# EAGLE design USB Serial (EAGLE 6.5.0)
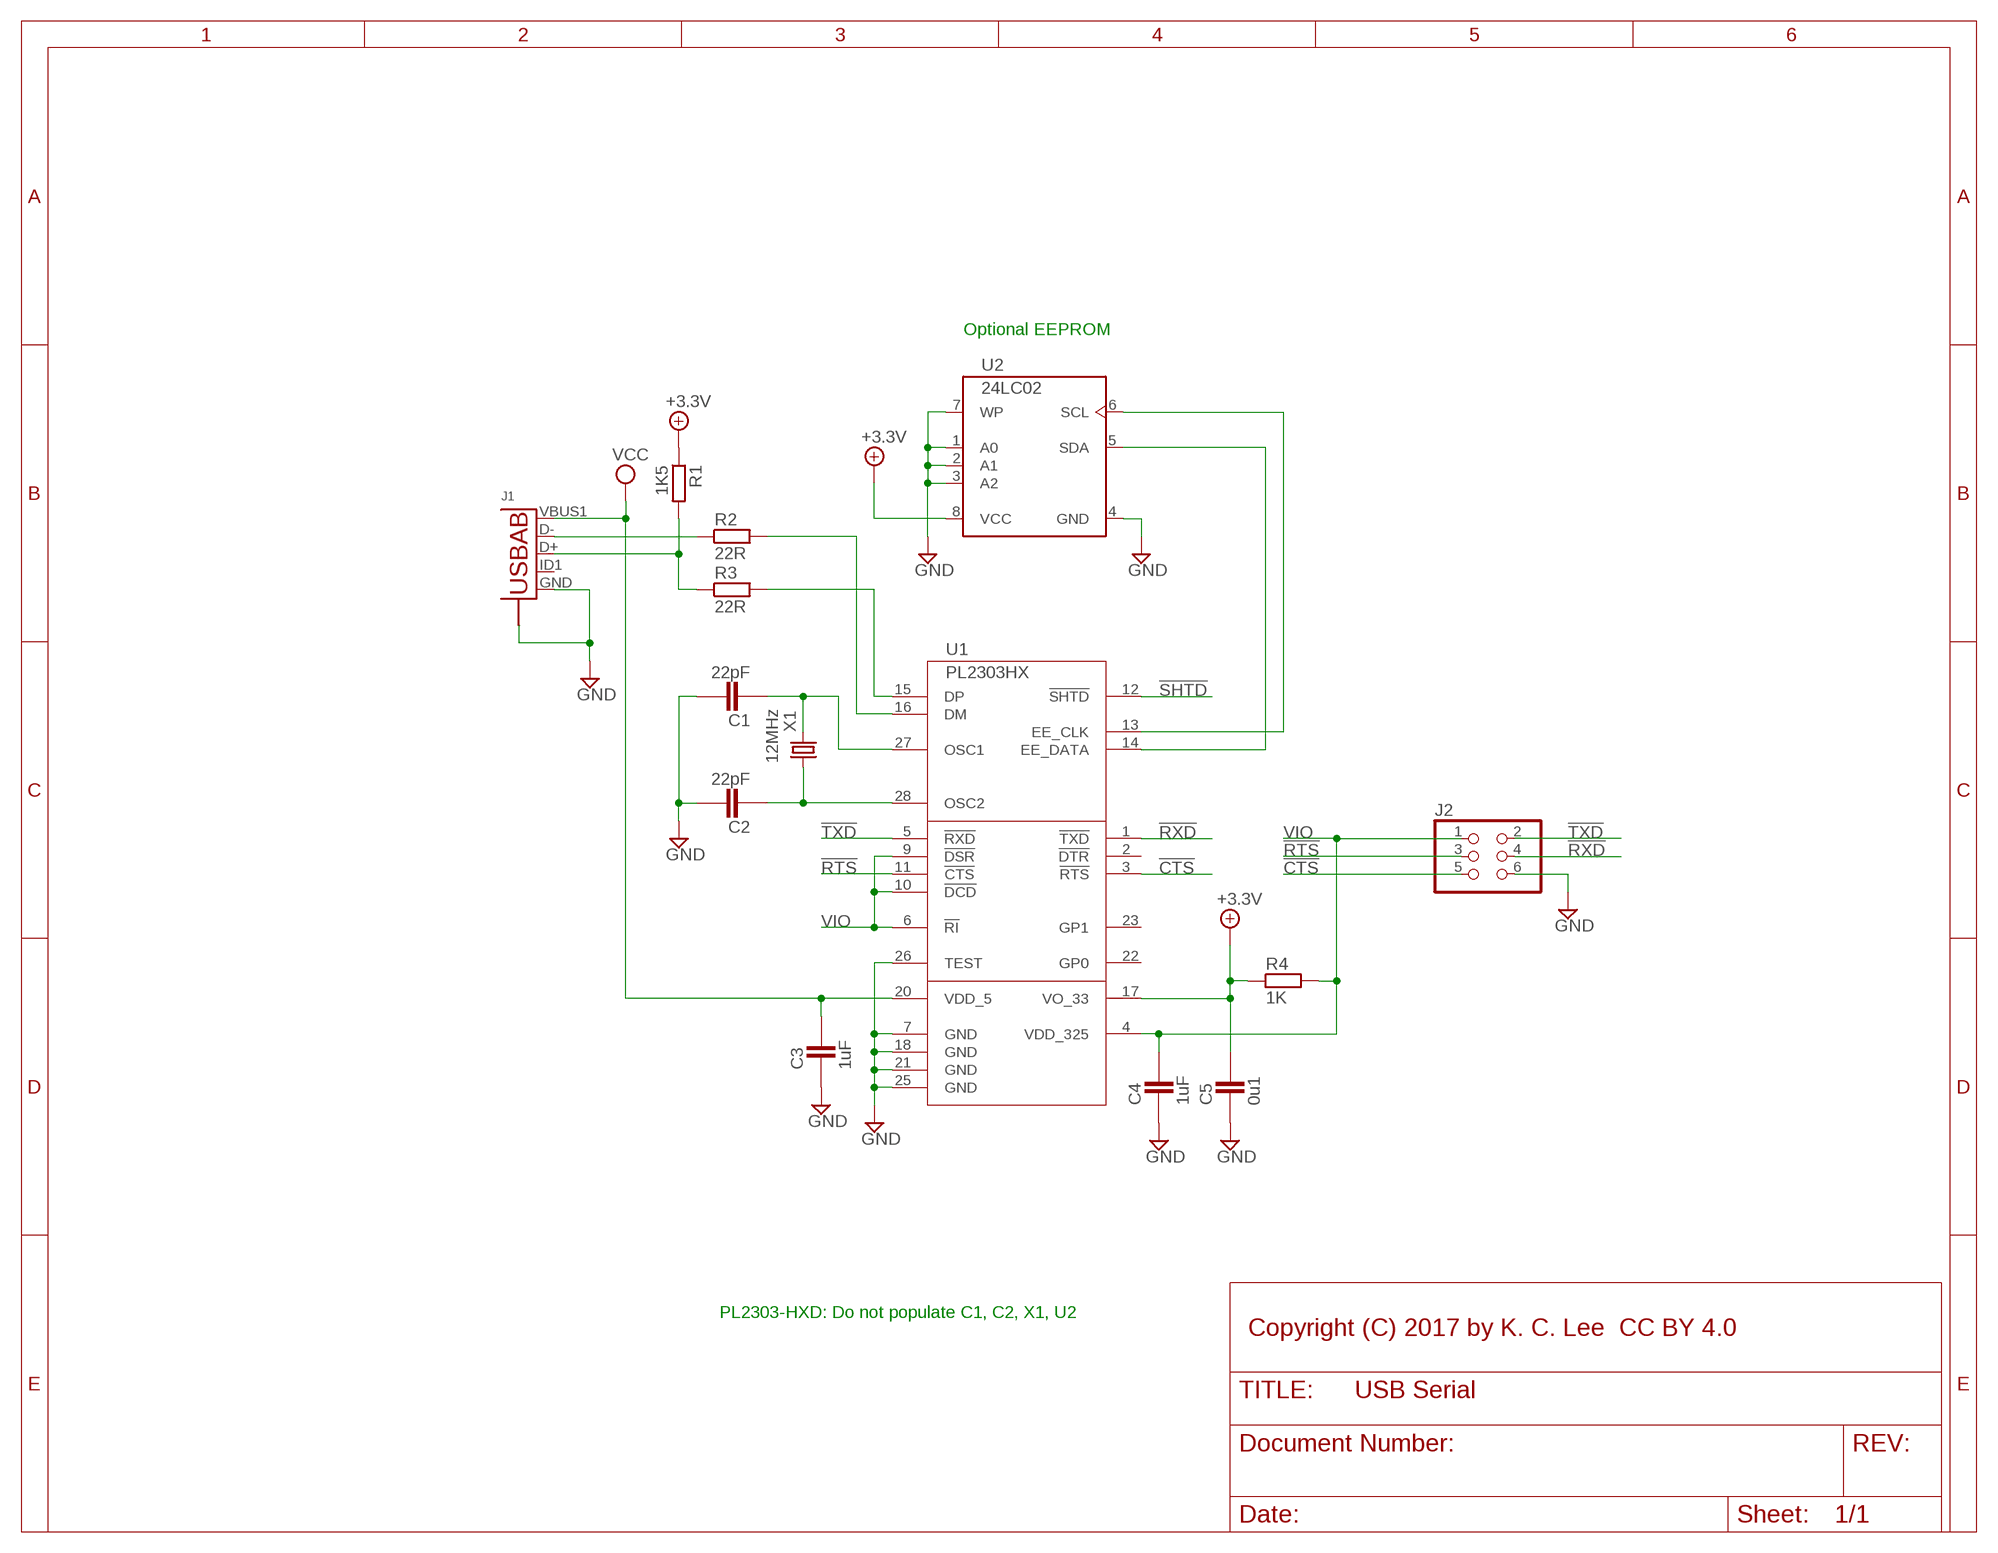
[diagram p0: schematic, sheet 1]

## Parts
C1  22pF  CAPACITOR_0603  [CAPC1608X92N]
C2  22pF  CAPACITOR_0603  [CAPC1608X92N]
C3  1uF  CAPACITOR_0603  [CAPC1608X92N]
C4  1uF  CAPACITOR_0603  [CAPC1608X92N]
C5  0u1  CAPACITOR_0603  [CAPC1608X92N]
J1  USB-ABBG-ORG  [USB-AB-MICRO-SMD_V03_SMT]
J2  PINHD-2X3_2.00  [2X03M_TH]
R1  1K5  RESISTOR_0603  [RESC1608X55N]
R2  22R  RESISTOR_0603  [RESC1608X55N]
R3  22R  RESISTOR_0603  [RESC1608X55N]
R4  1K  RESISTOR_0603  [RESC1608X55N]
U1  PL2303HX  PL2303HXASSOP  [SSOP28DB]
U2  24LC02  24ST  [TSSOP8]
X1  12MHz  CRYSTALTC26H  [TC26H]

## Nets
!CTS: J2.5 U1.3(!RTS)
!RTS: J2.3 U1.11(!CTS)
!RXD: J2.4 U1.1(!TXD)
!SHTD: U1.12(!SHTD)
!TXD: J2.2 U1.5(!RXD)
+3.3V: C5.2 R1.1 R4.1 U1.17(VO_33) U2.8(VCC)
GND: C1.2 C2.2 C3.1 C4.1 C5.1 J1.GND J1.S1(S) J1.S2(S) J1.S3(S) J1.S4(S) J2.6 U1.7(GND) U1.18(GND) U1.21(GND) U1.25(GND) U1.26(TEST) U2.1(A0) U2.2(A1) U2.3(A2) U2.4(GND) U2.7(WP)
N$4: R3.2 U1.15(DP)
N$5: J1.D+ R1.2 R3.1
N$6: J1.D- R2.1
N$7: R2.2 U1.16(DM)
N$9: U1.14(EE_DATA) U2.5(SDA)
N$10: U1.13(EE_CLK) U2.6(SCL)
N$13: C1.1 U1.27(OSC1) X1.2
N$14: C2.1 U1.28(OSC2) X1.1
VCC: C3.2 J1.VBUS1(VBUS) U1.20(VDD_5)
VIO: C4.2 J2.1 R4.2 U1.4(VDD_325) U1.6(!RI) U1.9(!DSR) U1.10(!DCD)
Unconnected: J1.ID1(USBID) U1.2(!DTR) U1.22(GP0) U1.23(GP1)

## Notes on the sheet
- Optional EEPROM
- PL2303-HXD: Do not populate C1, C2, X1, U2 | Copyright (C) 2017 by K. C. Lee  CC BY 4.0

## Library data of the parts
C1 C2 = ipc-7351-capacitor:CAPACITOR_; PARTNO: 22PF 0603
C3 C4 = ipc-7351-capacitor:CAPACITOR_; PARTNO: 1UF X7R 0603
C5 = ipc-7351-capacitor:CAPACITOR_; PARTNO: 0U1 X7R 0603
J1 = Misc Conn:USB-AB: This is a USB AB connector that is compatible with USB OTG. i.e. this connector can serve as a host or device; PARTNO: SMT MICRO USB FEMALE
J2 = Misc Conn:PINHD-2X3: PIN HEADER; PARTNO: 3X2 HEADER 2MM THROUGH HOLE
R1 = ipc-7351-resistor:RESISTOR_; PARTNO: 1K5 0603
R2 R3 = ipc-7351-resistor:RESISTOR_; PARTNO: 22R 0603
R4 = ipc-7351-resistor:RESISTOR_; PARTNO: 1K 0603
U1 = Misc Peripherals:PL2303HXA; PARTNO: PL-2303HXD SSOP
U2 = Misc Memory:24*; PARTNO: 24LC02
X1 = crystal:CRYSTAL: CRYSTAL; OC_FARNELL: unknown; OC_NEWARK: unknown; PARTNO: 12MHZ TC26

## Net classes
1 diff: width 0.003 mm, drill 0.006 mm, clearance 0.007 mm

## Board
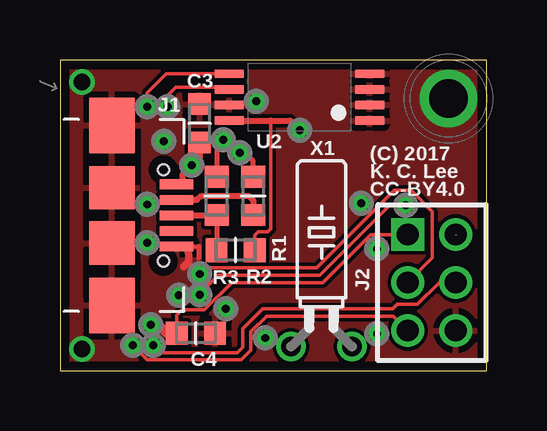
[diagram p1: board, top side]
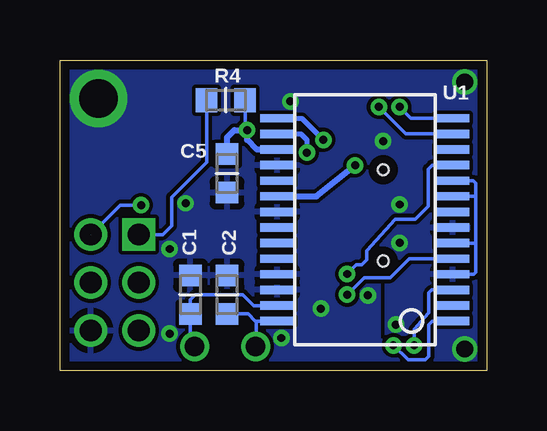
[diagram p2: board, bottom side, seen from below]

Size 17.78 x 12.95 mm. Coordinates in mm from the lower left corner, seen from the top.
Outline: 0,0 17.78,0 17.78,12.95 0,12.95 0,0
Copper layers (1*16): Top 0.0356mm / dielectric 1.5011mm / Bottom 0.0356mm
Design rules "oshpark-2layer-tented-vias": minimum track width 6mil, minimum drill 13mil, track to track 6mil, track to pad 6mil, pad to pad 6mil, via to via 6mil, smd to smd 6mil, copper to edge 15mil, drill to drill 6mil, minimum pad ring 7mil, minimum via ring 7mil, stop-mask expansion 4mil, vias tented up to drill 13mil, thermal gap 10mil
tRestrict: 12 lines
bRestrict: 1 lines

### Footprints (pad centres in the part's own frame; a part is rotated, then mirrored left to right if it is on the bottom)
CAPC1608X92N = smd 0.9 x 0.95: 1 -0.8,0; 2 0.8,0
USB-AB-MICRO-SMD_V03_SMT = smd 1.4 x 0.4: D+ 2.7,0; D- 2.7,0.65; GND 2.7,-1.3; ID1 2.7,-0.65; VBUS1 2.7,1.3 | smd 1.9 x 2.3: S1 0,3.75; S4 0,-3.75 | smd 1.9 x 1.8: S2 0,1.15; S3 0,-1.15 | hole 0.45: 2.15,1.9; 2.15,-1.9
2X03M_TH = drill 0.914 square: 1 -2,-1 | drill 0.914: 2 -2,1; 3 0,-1; 4 0,1; 5 2,-1; 6 2,1
RESC1608X55N = smd 0.9 x 1: 1 -0.8,0; 2 0.8,0
SSOP28DB = smd 0.348 x 1.397: 1 -4.225,-3.656; 2 -3.575,-3.656; 3 -2.925,-3.656; 4 -2.275,-3.656; 5 -1.625,-3.656; 6 -0.975,-3.656; 7 -0.325,-3.656; 8 0.325,-3.656; 9 0.975,-3.656; 10 1.625,-3.656; 11 2.275,-3.656; 12 2.925,-3.656; 13 3.575,-3.656; 14 4.225,-3.656; 15 4.225,3.656; 16 3.575,3.656; 17 2.925,3.656; 18 2.275,3.656; 19 1.625,3.656; 20 0.975,3.656; 21 0.325,3.656; 22 -0.325,3.656; 23 -0.975,3.656; 24 -1.625,3.656; 25 -2.275,3.656; 26 -2.925,3.656; 27 -3.575,3.656; 28 -4.225,3.656
TSSOP8 = smd 0.35 x 1.2: 1 -0.975,-2.925; 2 -0.325,-2.925; 3 0.325,-2.925; 4 0.975,-2.925; 5 0.975,2.925; 6 0.325,2.925; 7 -0.325,2.925; 8 -0.975,2.925
TC26H = drill 0.813: 1 -1.27,0; 2 1.27,0

### Placement (x,y rotation side)
C1  12.34,3.17 90 bottom
C2  10.82,3.17 90 bottom
C3  5.82,10.31 270 top
C4  5.66,1.57 180 top
C5  10.82,8.23 90 bottom
J1  2.16,6.48 0 top
J2  15.49,3.68 270 top
R1  7.32,5.03 180 top
R2  8.05,7.29 90 top
R3  6.53,7.29 90 top
R4  10.87,11.28 180 bottom
U1  5.08,6.3 90 bottom
U2  9.98,11.4 90 top
X1  10.9,1.02 0 top

### Tracks (layer width: path | path; a pad name or v marks a point on that pad's centre or on a via)
!CTS  (via drill 0.33)
  Top 0.152: J2.5 13.89,2.29 8.61,2.29 7.95,1.63 7.95,0.86 7.54,0.46 3.63,0.46 v3.02,1.07
  Bottom 0.152: v3.02,1.07 3.02,1.73 2.41,2.41 2.41,3.25 2.29,3.37 U1.3
!RTS  (via drill 0.33)
  Top 0.152: J2.3 15.52,4.71 15.52,6.63 14.63,7.52 13.92,7.52 10.69,4.29 6.07,4.29 v5.82,4.04
  Bottom 0.152: U1.11 2.27,8.57 2.44,8.41 2.44,6.86 2.97,6.33 3.81,6.33 5,5 5,4.62 5.21,4.42 5.44,4.42 v5.82,4.04
!RXD  (via drill 0.33)
  Top 0.152: v3.89,1.07 4.19,0.76 7.39,0.76 7.62,0.99 7.62,1.75 8.46,2.59 13.87,2.59 14.05,2.77 14.88,2.77 15.8,3.68 J2.4
  Bottom 0.152: U1.1 2.27,2.07 2.41,1.93 2.41,0.61 2.56,0.46 3.28,0.46 v3.89,1.07 | J2.4
!TXD  (via drill 0.33)  (1 unrouted)
  Top 0.152: v5.82,3.17 5.79,3.17 6.6,3.99 10.82,3.99 13.74,6.91 v14.4,6.91
  Bottom 0.152: v5.82,3.17 5.11,3.89 4.01,3.89 3.23,4.67 U1.5 | 16.5,5.68 16.5,5.69 | v14.4,6.91 15.27,6.91 J2.2
+3.3V  (via drill 0.33)
  Top 0.152: R1.1 8.12,5.65 8.26,5.79 8.66,5.79 8.79,5.92 8.79,10.4 8.76,10.43
  Top 0.254: U2.8 8.76,10.43 9.59,10.43 v9.98,10.03
  Bottom 0.152: R4.1 10.07,10.12 v9.98,10.03
  Bottom 0.254: U1.17 9.58,9.22 9.98,9.63 v9.98,10.03 10.52,10.03 10.82,9.73 C5.2
GND  (via drill 0.33, 0.7, 1.6)
  Top 0.152: v3.63,5.33 3.66,5.28 | J1.GND 5.81,5.18 5.79,5.18 | 5.79,4.72 5.77,4.67
  Top 0.178: 3.66,5.28 4.88,5.28
  Top 0.203: 5.79,5.18 5.79,4.72
  Top 0.305: J1.GND 5.3,5.18 5.33,5.21 5.36,4.55 5.16,4.34
  other vias: 13.21,1.55 8.56,1.37 8.18,11.23 4.32,9.58 0.91,0.91 4.95,3.15 13.21,5.08 6.91,2.59 3.63,6.93 12.55,6.99 16.18,11.35 0.91,12.04
  pour Top (rank 6): 0,13.08 17.78,13.08 17.78,0 0,0
  pour Bottom (rank 6): 17.78,13.08 0,13.08 0,0 17.78,0
N$4  (via drill 0.33)
  Top 0.203: R3.2 6.55,8.18 6.55,9.37 v6.81,9.63
  Bottom 0.203: U1.15 7.71,10.52 v6.81,9.63
N$5
  Top 0.203: R3.1 6.53,5.07 R1.2
  Top 0.254: J1.D+ 6.79,6.48
  Top 0.305: 6.79,6.48 R3.1
N$6
  Top 0.254: J1.D- 5.71,7.13 5.89,7.29 7.87,7.29 8.05,7.11 R2.1
N$7  (via drill 0.33)
  Top 0.203: R2.2 8.05,8.74 7.72,9.04 7.67,9.09 v7.49,9.09
  Bottom 0.203: v7.49,9.09 7.49,9.63 7.74,9.87 U1.16
N$9  (via drill 0.33)
  Top 0.152: U2.5 4.43,12.38 3.63,11.58 v3.63,11
  Bottom 0.152: v3.63,11 3.16,10.52 U1.14
N$10  (via drill 0.33)
  Top 0.152: v4.5,11 4.5,11.48 4.83,11.81 6.55,11.81 6.63,11.73 U2.6
  Bottom 0.152: v4.5,11 3.37,9.87 U1.13
N$13
  Bottom 0.152: U1.27 9.71,2.72 10.16,3.17 12.14,3.17 12.34,2.97 C1.1 12.34,1.19 X1.2
N$14
  Bottom 0.152: U1.28 9.61,2.07 | 9.61,2.07 9.64,2.07 9.94,2.38 C2.1 | 9.61,2.07 9.61,1.03 X1.1
VCC  (via drill 0.33)
  Top 0.254: C3.2 5.82,8.89 v5.49,8.56 5.11,8.18 5.11,7.85 5.03,7.78 J1.VBUS1
  Bottom 0.254: v5.49,8.56 7.1,7.27 U1.20
VIO  (via drill 0.33)
  Top 0.152: C4.2 4.86,2.32 5.08,2.54 6.02,2.54 7.16,3.68 10.95,3.68 12.95,5.68 J2.1
  Top 0.406: C4.2 4.45,1.57 4.09,1.93 v3.79,1.93
  Bottom 0.152: U1.10 0.56,7.92 0.46,7.82 0.46,7.24 | 0.46,7.24 0.46,5.33 | 0.46,5.33 0.46,4.12 0.55,4.02 U1.4 | U1.9 0.49,7.27 0.46,7.24 | U1.6 0.47,5.32 0.46,5.33 | J2.1 13.49,5.68 13.13,6.04 13.13,7.24 11.67,8.7 R4.2
  pour Bottom: 0.76,4.45 4.19,4.45 4.19,1.52 0.76,1.52

### Text on the board
tPlace: (C) 2017 | K. C. Lee | CC-BY4.0